# Altium schematic sheet USB.SchDoc
size 580 x 240 mm; SheetNumber: 5; SheetTotal: 6
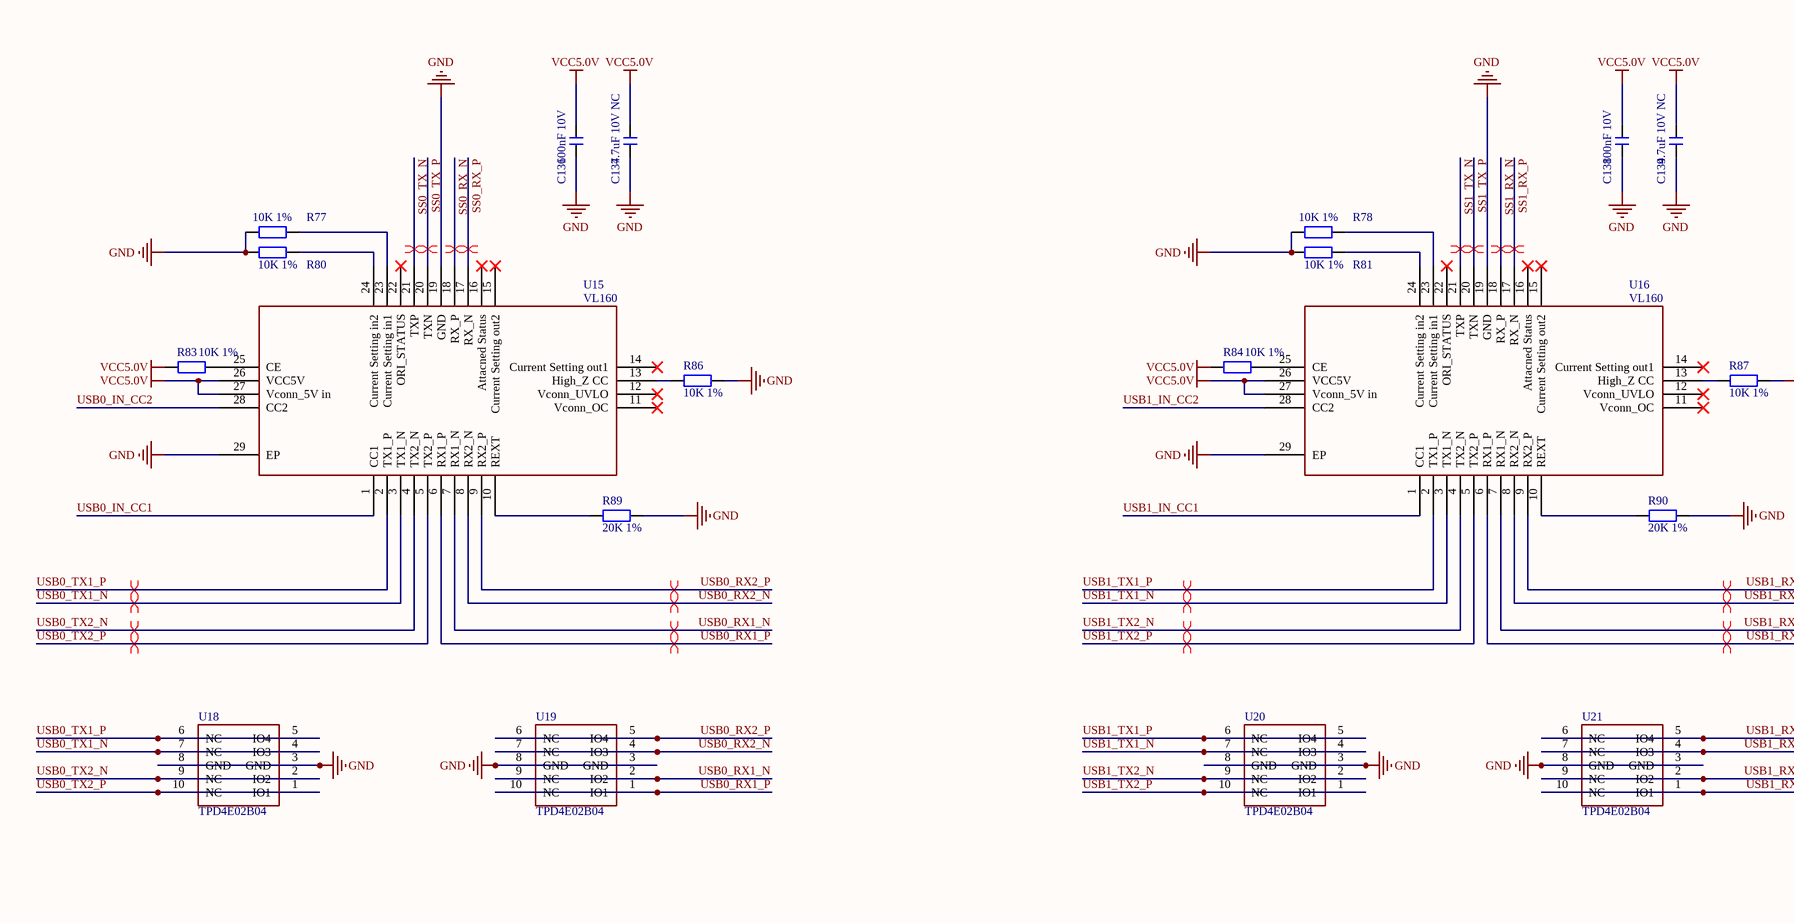
[diagram p0: USB.SchDoc, left]
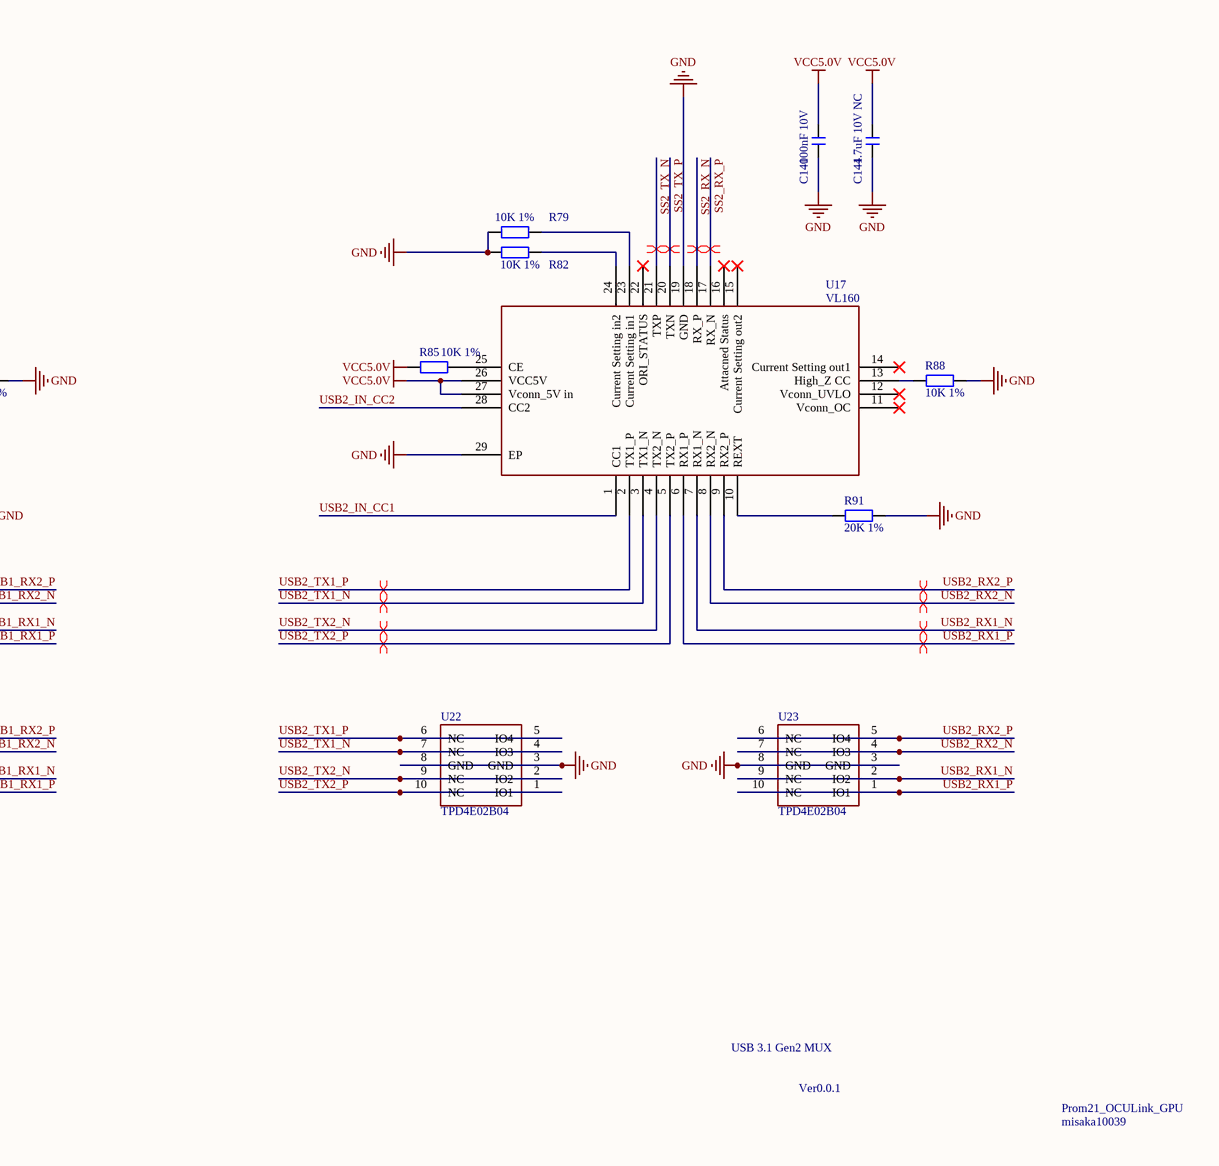
[diagram p1: USB.SchDoc, right]

## Parts
C136  100nF 10V  [C0402_L]
C137  4.7uF 10V NC  [C0402_L]
C138  100nF 10V  [C0402_L]
C139  4.7uF 10V NC  [C0402_L]
C140  100nF 10V  [C0402_L]
C141  4.7uF 10V NC  [C0402_L]
R77  10K 1%  [R0402_L]
R78  10K 1%  [R0402_L]
R79  10K 1%  [R0402_L]
R80  10K 1%  [R0402_L]
R81  10K 1%  [R0402_L]
R82  10K 1%  [R0402_L]
R83  10K 1%  [R0402_L]
R84  10K 1%  [R0402_L]
R85  10K 1%  [R0402_L]
R86  10K 1%  [R0402_L]
R87  10K 1%  [R0402_L]
R88  10K 1%  [R0402_L]
R89  20K 1%  [R0402_L]
R90  20K 1%  [R0402_L]
R91  20K 1%  [R0402_L]
U15  VL160  [MQFN-28_L4.5-W3.5-P0.40-BL-EP]
U16  VL160  [MQFN-28_L4.5-W3.5-P0.40-BL-EP]
U17  VL160  [MQFN-28_L4.5-W3.5-P0.40-BL-EP]
U18  TPD4E02B04  [DIO_TPD4E02B04DQAR]
U19  TPD4E02B04  [DIO_TPD4E02B04DQAR]
U20  TPD4E02B04  [DIO_TPD4E02B04DQAR]
U21  TPD4E02B04  [DIO_TPD4E02B04DQAR]
U22  TPD4E02B04  [DIO_TPD4E02B04DQAR]
U23  TPD4E02B04  [DIO_TPD4E02B04DQAR]

## Nets
GND: C136.1 C137.1 C138.1 C139.1 C140.1 C141.1 R77.1 R78.1 R79.1 R80.1 R81.1 R82.1 R86.1 R87.1 R88.1 R89.1 R90.1 R91.1 U15.19(GND) U15.29(EP) U16.19(GND) U16.29(EP) U17.19(GND) U17.29(EP) U18.3(GND) U18.8(GND) U19.3(GND) U19.8(GND) U20.3(GND) U20.8(GND) U21.3(GND) U21.8(GND) U22.3(GND) U22.8(GND) U23.3(GND) U23.8(GND)
VCC5.0V: C136.2 C137.2 C138.2 C139.2 C140.2 C141.2 R83.2 R84.2 R85.2 U15.26(VCC5V) U15.27(Vconn_5V_in) U16.26(VCC5V) U16.27(Vconn_5V_in) U17.26(VCC5V) U17.27(Vconn_5V_in)
SS0_RX_N: U15.18(RX_P)
SS0_RX_P: U15.17(RX_N)
SS0_TX_N: U15.21(TXP)
SS0_TX_P: U15.20(TXN)
SS1_RX_N: U16.18(RX_P)
SS1_RX_P: U16.17(RX_N)
SS1_TX_N: U16.21(TXP)
SS1_TX_P: U16.20(TXN)
SS2_RX_N: U17.18(RX_P)
SS2_RX_P: U17.17(RX_N)
SS2_TX_N: U17.21(TXP)
SS2_TX_P: U17.20(TXN)
USB0_IN_CC1: U15.1(CC1)
USB0_IN_CC2: U15.28(CC2)
USB0_RX1_N: U15.7(RX1_N) U19.2(IO2) U19.9(NC)
USB0_RX1_P: U15.6(RX1_P) U19.1(IO1) U19.10(NC)
USB0_RX2_N: U15.8(RX2_N) U19.4(IO3) U19.7(NC)
USB0_RX2_P: U15.9(RX2_P) U19.5(IO4) U19.6(NC)
USB0_TX1_N: U15.3(TX1_N) U18.4(IO3) U18.7(NC)
USB0_TX1_P: U15.2(TX1_P) U18.5(IO4) U18.6(NC)
USB0_TX2_N: U15.4(TX2_N) U18.2(IO2) U18.9(NC)
USB0_TX2_P: U15.5(TX2_P) U18.1(IO1) U18.10(NC)
USB1_IN_CC1: U16.1(CC1)
USB1_IN_CC2: U16.28(CC2)
USB1_RX1_N: U16.7(RX1_N) U21.2(IO2) U21.9(NC)
USB1_RX1_P: U16.6(RX1_P) U21.1(IO1) U21.10(NC)
USB1_RX2_N: U16.8(RX2_N) U21.4(IO3) U21.7(NC)
USB1_RX2_P: U16.9(RX2_P) U21.5(IO4) U21.6(NC)
USB1_TX1_N: U16.3(TX1_N) U20.4(IO3) U20.7(NC)
USB1_TX1_P: U16.2(TX1_P) U20.5(IO4) U20.6(NC)
USB1_TX2_N: U16.4(TX2_N) U20.2(IO2) U20.9(NC)
USB1_TX2_P: U16.5(TX2_P) U20.1(IO1) U20.10(NC)
USB2_IN_CC1: U17.1(CC1)
USB2_IN_CC2: U17.28(CC2)
USB2_RX1_N: U17.7(RX1_N) U23.2(IO2) U23.9(NC)
USB2_RX1_P: U17.6(RX1_P) U23.1(IO1) U23.10(NC)
USB2_RX2_N: U17.8(RX2_N) U23.4(IO3) U23.7(NC)
USB2_RX2_P: U17.9(RX2_P) U23.5(IO4) U23.6(NC)
USB2_TX1_N: U17.3(TX1_N) U22.4(IO3) U22.7(NC)
USB2_TX1_P: U17.2(TX1_P) U22.5(IO4) U22.6(NC)
USB2_TX2_N: U17.4(TX2_N) U22.2(IO2) U22.9(NC)
USB2_TX2_P: U17.5(TX2_P) U22.1(IO1) U22.10(NC)
NetR77_2: R77.2 U15.23(Current_Setting_in1)
NetR78_2: R78.2 U16.23(Current_Setting_in1)
NetR79_2: R79.2 U17.23(Current_Setting_in1)
NetR80_2: R80.2 U15.24(Current_Setting_in2)
NetR81_2: R81.2 U16.24(Current_Setting_in2)
NetR82_2: R82.2 U17.24(Current_Setting_in2)
NetR83_1: R83.1 U15.25(CE)
NetR84_1: R84.1 U16.25(CE)
NetR85_1: R85.1 U17.25(CE)
NetR86_2: R86.2 U15.13(High_Z_CC)
NetR87_2: R87.2 U16.13(High_Z_CC)
NetR88_2: R88.2 U17.13(High_Z_CC)
NetR89_2: R89.2 U15.10(REXT)
NetR90_2: R90.2 U16.10(REXT)
NetR91_2: R91.2 U17.10(REXT)

Not connected (* = marked no-connect by the designer): U15 11(Vconn_OC)* 12(Vconn_UVLO)* 14(Current_Setting_out1)* 15(Current_Setting_out2)* 16(Attacned_Status)* 22(ORI_STATUS)*; U16 11(Vconn_OC)* 12(Vconn_UVLO)* 14(Current_Setting_out1)* 15(Current_Setting_out2)* 16(Attacned_Status)* 22(ORI_STATUS)*; U17 11(Vconn_OC)* 12(Vconn_UVLO)* 14(Current_Setting_out1)* 15(Current_Setting_out2)* 16(Attacned_Status)* 22(ORI_STATUS)*

## Layout directives
differential pair: SS0_RX_N, SS0_RX_P, SS0_TX_N, SS0_TX_P, SS1_RX_N, SS1_RX_P, SS1_TX_N, SS1_TX_P, SS2_RX_N, SS2_RX_P, SS2_TX_N, SS2_TX_P, USB0_RX1_N, USB0_RX1_P, USB0_RX2_N, USB0_RX2_P, USB0_TX1_N, USB0_TX1_P, USB0_TX2_N, USB0_TX2_P, USB1_RX1_N, USB1_RX1_P, USB1_RX2_N, USB1_RX2_P, USB1_TX1_N, USB1_TX1_P, USB1_TX2_N, USB1_TX2_P, USB2_RX1_N, USB2_RX1_P, USB2_RX2_N, USB2_RX2_P, USB2_TX1_N, USB2_TX1_P, USB2_TX2_N, USB2_TX2_P

## Notes on the sheet
- USB 3.1 Gen2 MUX
- Ver0.0.1
- Prom21_OCULink_GPU
- misaka10039

## Library data of the parts
C136-C141 = C: 无极性贴片电容; 版权归属: 源创客; 材质: X7R; BOM名称: 无极性贴片电容; 学习资源: www.ooocke.com
R77-R91 = R: 贴片电阻; 版权归属: 源创客; BOM名称: 贴片电阻; 学习资源: www.ooocke.com
U18-U23 = TPD4E02B04: ESD